# Altium schematic sheet Micro.SchDoc
size B
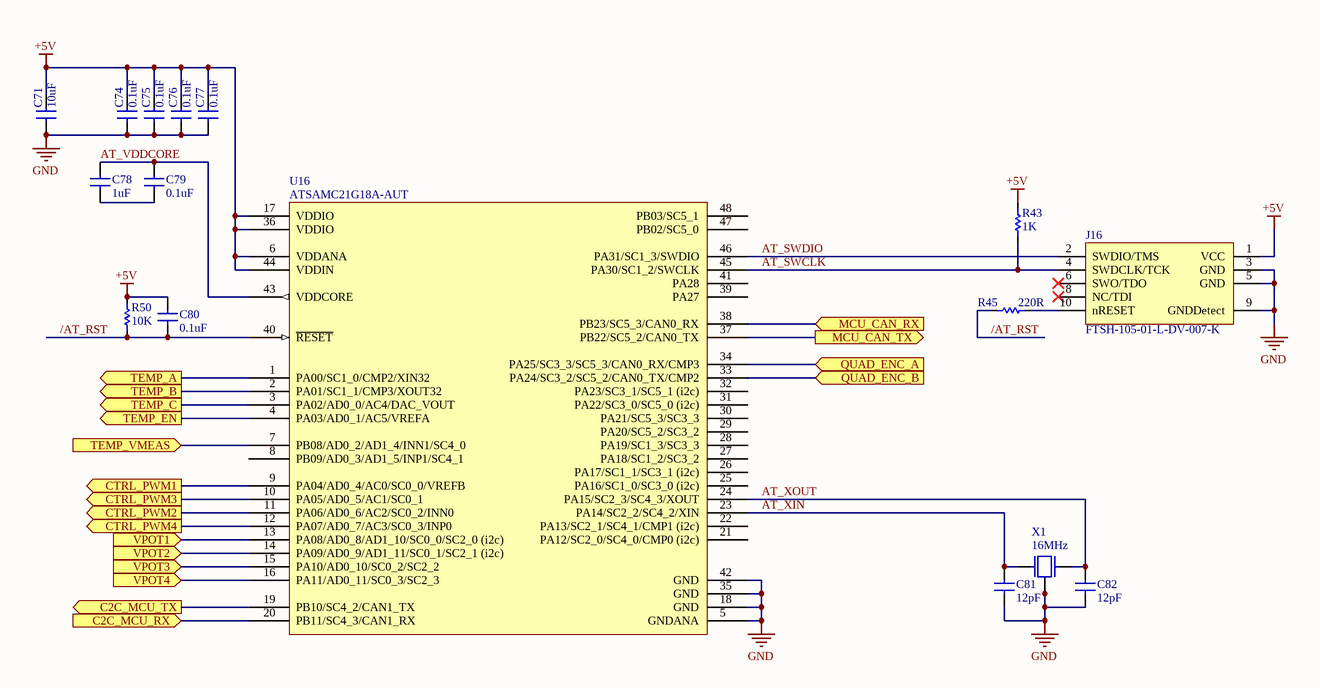
[diagram p0: Micro.SchDoc]

## Parts
C71  value 10uF  [0603_Capacitor]  (hidden comment: CAP 10uF 6.3V X5R)
C74  value 0.1uF  [0402_CAPACITOR]  (hidden comment: CAP 0.1uF 16V X7R)
C75  value 0.1uF  [0402_CAPACITOR]  (hidden comment: CAP 0.1uF 16V X7R)
C76  value 0.1uF  [0402_CAPACITOR]  (hidden comment: CAP 0.1uF 16V X7R)
C77  value 0.1uF  [0402_CAPACITOR]  (hidden comment: CAP 0.1uF 16V X7R)
C78  value 1uF  [0603_CAPACITOR]  (hidden comment: CAP 1uF 16V X7R)
C79  value 0.1uF  [0402_CAPACITOR]  (hidden comment: CAP 0.1uF 16V X7R)
C80  value 0.1uF  [0402_CAPACITOR]  (hidden comment: CAP 0.1uF 16V X7R)
C81  value 12pF  [0402_CAPACITOR]  (hidden comment: C_0402_12pF_C0G/NP0_50V_5%)
C82  value 12pF  [0402_CAPACITOR]  (hidden comment: C_0402_12pF_C0G/NP0_50V_5%)
J16  FTSH-105-01-L-DV-007-K  [J_Cortex_JTAG_SMD]
R43  value 1K  [0402_Resistor]  (hidden comment: R_0402_1K_1%)
R45  value 220R  [0402_Resistor]  (hidden comment: R_0402_220R_1%)
R50  value 10K  [0402_Resistor]  (hidden comment: R_0402_10K_1%)
U16  ATSAMC21G18A-AUT  [TQFP-48]
X1  value 16MHz  [X_TSX-3225]  (hidden comment: TSX-3225_16.0000MF18X)

## Ports
C2C_MCU_RX (in), C2C_MCU_TX (out), CTRL_PWM1 (out), CTRL_PWM2 (out), CTRL_PWM3 (out), CTRL_PWM4 (out), MCU_CAN_RX (in), MCU_CAN_TX (out), QUAD_ENC_A (in), QUAD_ENC_B (in), TEMP_A (out), TEMP_B (out), TEMP_C (out), TEMP_EN (out), TEMP_VMEAS (in), VPOT1 (in), VPOT2 (in), VPOT3 (in), VPOT4 (in)

## Nets
+5V: C71.1 C74.1 C75.1 C76.1 C77.1 C80.1 J16.1(VCC) R43.1 R50.1 U16.6(VDDANA) U16.17(VDDIO) U16.36(VDDIO) U16.44(VDDIN)
GND: C71.2 C74.2 C75.2 C76.2 C77.2 C81.2 C82.2 J16.3(GND) J16.5(GND) J16.9(GNDDetect) U16.5(GNDANA) U16.18(GND) U16.35(GND) U16.42(GND) X1.2 X1.4
/AT_RST: C80.2 R45.1 R50.2 U16.40(~{RESET})
AT_SWCLK: J16.4(SWDCLK/TCK) R43.2 U16.45(PA30/SC1_2/SWCLK)
AT_SWDIO: J16.2(SWDIO/TMS) U16.46(PA31/SC1_3/SWDIO)
AT_VDDCORE: C78.2 C79.2 U16.43(VDDCORE)
AT_XIN: C81.1 U16.23(PA14/SC2_2/SC4_2/XIN) X1.1
AT_XOUT: C82.1 U16.24(PA15/SC2_3/SC4_3/XOUT) X1.3
C2C_MCU_RX: U16.20(PB11/SC4_3/CAN1_RX) ; port C2C_MCU_RX
C2C_MCU_TX: U16.19(PB10/SC4_2/CAN1_TX) ; port C2C_MCU_TX
CTRL_PWM1: U16.9(PA04/AD0_4/AC0/SC0_0/VREFB) ; port CTRL_PWM1
CTRL_PWM2: U16.11(PA06/AD0_6/AC2/SC0_2/INN0) ; port CTRL_PWM2
CTRL_PWM3: U16.10(PA05/AD0_5/AC1/SC0_1) ; port CTRL_PWM3
CTRL_PWM4: U16.12(PA07/AD0_7/AC3/SC0_3/INP0) ; port CTRL_PWM4
MCU_CAN_RX: U16.38(PB23/SC5_3/CAN0_RX) ; port MCU_CAN_RX
MCU_CAN_TX: U16.37(PB22/SC5_2/CAN0_TX) ; port MCU_CAN_TX
QUAD_ENC_A: U16.34(PA25/SC3_3/SC5_3/CAN0_RX/CMP3) ; port QUAD_ENC_A
QUAD_ENC_B: U16.33(PA24/SC3_2/SC5_2/CAN0_TX/CMP2) ; port QUAD_ENC_B
TEMP_A: U16.1(PA00/SC1_0/CMP2/XIN32) ; port TEMP_A
TEMP_B: U16.2(PA01/SC1_1/CMP3/XOUT32) ; port TEMP_B
TEMP_C: U16.3(PA02/AD0_0/AC4/DAC_VOUT) ; port TEMP_C
TEMP_EN: U16.4(PA03/AD0_1/AC5/VREFA) ; port TEMP_EN
TEMP_VMEAS: U16.7(PB08/AD0_2/AD1_4/INN1/SC4_0) ; port TEMP_VMEAS
VPOT1: U16.13(PA08/AD0_8/AD1_10/SC0_0/SC2_0_(i2c)) ; port VPOT1
VPOT2: U16.14(PA09/AD0_9/AD1_11/SC0_1/SC2_1_(i2c)) ; port VPOT2
VPOT3: U16.15(PA10/AD0_10/SC0_2/SC2_2) ; port VPOT3
VPOT4: U16.16(PA11/AD0_11/SC0_3/SC2_3) ; port VPOT4
NetC78_1: C78.1 C79.1
NetJ16_10: J16.10(nRESET) R45.2

Not connected (* = marked no-connect by the designer): J16 6(SWO/TDO)* 8(NC/TDI)*; U16 8(PB09/AD0_3/AD1_5/INP1/SC4_1) 21(PA12/SC2_0/SC4_0/CMP0_(i2c)) 22(PA13/SC2_1/SC4_1/CMP1_(i2c)) 25(PA16/SC1_0/SC3_0_(i2c)) 26(PA17/SC1_1/SC3_1_(i2c)) 27(PA18/SC1_2/SC3_2) 28(PA19/SC1_3/SC3_3) 29(PA20/SC5_2/SC3_2) 30(PA21/SC5_3/SC3_3) 31(PA22/SC3_0/SC5_0_(i2c)) 32(PA23/SC3_1/SC5_1_(i2c)) 39(PA27) 41(PA28) 47(PB02/SC5_0) 48(PB03/SC5_1)

## Library data of the parts
C71 = C_0603_10uF_6.3V_20%: CAP CER 10UF 6.3V X5R 0603; Package: =SelectedPackage; Voltage: 6.3V; Temperature Coefficient: X5R; Supplier 1: Digi-Key; Supplier Part Number 1: 1276-1119-1-ND
C74-C77 C79 C80 = C_0402_0.1uF_16V_10%: CAP CERM 0.1uF 10% 16V 0402; Package: =SelectedPackage; Voltage: 16V; Temperature Coefficient: X7R; Supplier 1: Digi-Key; Supplier Part Number 1: 1276-1001-1-ND; Supplier 2: Digi-Key; Supplier Part Number 2: 587-1451-1-ND
C78 = C_0603_1uF_16V_10%: CAP CERM 1uF 10% 16V 0603; SVP Creator: Spencer Berglund; Package: =SelectedPackage; Voltage: 16V; Temperature Coefficient: X7R; Supplier 1: Digi-Key; Supplier Part Number 1: 1276-6524-6-ND
C81 C82 = C_0402_generic_C0G/NP0_50V_5%: Generic 0402 C0G/NP0 50V 5% ceramic capacitor / Valid values range from 10pF to 1000pF with E24 selection (1.0, 1.1, 1.2, 1.3, 1.5, 1.6, 1.8, 2.0, 2.2, 2.4, 2.7, 3.0, 3.3, 3.6, 3.9, 4.3, 4.7, 5.1, 5.6, 6.2, 6.8, 7.5, 8.2, 9.1), although E12 are more common; Manufacturer: Samsung; Temperature Coefficient: C0G, NP0; Package: =SelectedPackage; Voltage: 50V; ValueFormatted: =Copy(Value,0,2)+Copy('012',Pos('p',Value)-2,1); Manufacturer Part Number: ='CL05C'+ValueFormatted+'JB5NNNC'; HelpURL: https://www.digikey.com/products/en/capacitors/ceramic-capacitors/60?k=&pkeyword=&sv=0&pv405=19&sf=0&FV=fffc04fc%2Cc0002%2Cc0003%2C1c0002%2C380020%2C400004%2C440012%2C3f00019%2C1f140000%2Cffe0003c%2Cmu1000pF%7C2049%2Cmu100pF%7C2049%2Cmu10pF%7C2049%2Cmu11pF%7C2049%2Cmu120pF%7C2049%2Cmu12pF%7C2049%2Cmu13pF%7C2049%2Cmu150pF%7C2049%2Cmu15pF%7C2049%2Cmu16pF%7C2049%2Cmu180pF%7C2049%2Cmu18pF%7C2049%2Cmu200pF%7C2049%2Cmu20pF%7C2049%2Cmu220pF%7C2049%2Cmu22pF%7C2049%2Cmu24pF%7C2049%2Cmu270pF%7C2049%2Cmu27pF%7C2049%2Cmu30pF%7C2049%2Cmu330pF%7C2049%2Cmu33pF%7C2049%2Cmu36pF%7C2049%2Cmu390pF%7C2049%2Cmu39pF%7C2049%2Cmu470pF%7C2049%2Cmu47pF%7C2049%2Cmu51pF%7C2049%2Cmu560pF%7C2049%2Cmu56pF%7C2049%2Cmu62pF%7C2049%2Cmu680pF%7C2049%2Cmu68pF%7C2049%2Cmu75pF%7C2049%2Cmu820pF%7C2049%2Cmu82pF%7C2049%2Cmu91pF%7C2049&ColumnSort=2049
J16 = J_Cortex_JTAG_SMD: CORTEX JTAG DEBUG CONNECTOR; Manufacturer: Samtec Inc; Manufacturer PN: FTSH-105-01-L-DV-007-K; Supplier 1: Digi-Key; Supplier Part Number 1: SAM9438-ND
R43 R45 R50 = R_0402_generic_1%: Generic 0402 Resistor (10.2R to 10M); Manufacturer: Yageo; Power Rating: 0.0625W; Temperature Coefficient: ±100ppm/°C; Tolerance: ±1%; Voltage Rating: 50V; Operating Temperature: -55°C ~ 155°C; Manufacturer Part Number: ='RC0402FR-07'+ValueFormatted+'L'; HelpURL: https://www.digikey.com/products/en/resistors/chip-resistor-surface-mount/52?pv17=103&FV=fffc000d%2Cc0001%2C1c0002%2C1f140000%2Cffe00034&k=RC0402; ValueFormatted: =Copy(Copy(Value, 0, Pos('.', Value)-1)+Copy(Value, Length(Value), 1)+Copy(Value, Pos('.', Value)+1, Length(Value)-Pos('.', Value)-1),1,Pos('.',Value)*Length(Value))+Copy(Value,1,Length(Value)*(1-Pos('.',Value)))
U16 = U_ATSAMC21G18A-AUT: ARM® Cortex®-M0+ SAM C21 Microcontroller IC 32-Bit 48MHz 256KB (256K x 8) FLASH 48-TQFP (7x7); Supplier 1: Digi-Key; Supplier Part Number 1: ATSAMC21G18A-AUTCT-ND
X1 = X_TSX-3225_16.0000MF18X: 16MHz ±10ppm Crystal 9pF 60 Ohms 4-SMD, No Lead; Manufacturer: Epson; Manufacturer Part Number: TSX-322516.0000MF18X-AC3; Frequency Stability: 18ppm; ESR (Equivalent Series Resistance): 60R; Supplier 1: Digi-Key; Supplier Part Number 1: SER3636CT-ND; Load Capacitance: 9pF; Frequency Tolerance: 10ppm; Max Operating Temperature: 85°C; Min Operating Temperature: -40°C